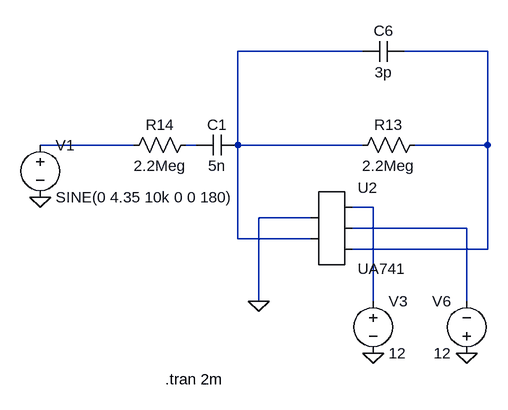
[diagram p0: schematic Filter.asc]
Filter.asc, the LTspice schematic file:
Version 4
SHEET 1 1892 832
WIRE 480 -128 288 -128
WIRE 672 -128 544 -128
WIRE 128 16 -16 16
WIRE 224 16 208 16
WIRE 288 16 288 -128
WIRE 480 16 288 16
WIRE 672 16 672 -128
WIRE 672 16 560 16
WIRE 496 112 464 112
WIRE 400 128 320 128
WIRE 640 144 464 144
WIRE 288 160 288 16
WIRE 400 160 288 160
WIRE 672 176 672 16
WIRE 672 176 464 176
WIRE 320 256 320 128
WIRE 496 256 496 112
WIRE 640 256 640 144
FLAG 320 256 0
FLAG 496 336 0
FLAG 640 336 0
FLAG -16 96 0
SYMBOL cap 288 0 R90
WINDOW 0 0 32 VBottom 2
WINDOW 3 32 32 VTop 2
SYMATTR InstName C1
SYMATTR Value 5n
SYMBOL cap 544 -144 R90
WINDOW 0 0 32 VBottom 2
WINDOW 3 32 32 VTop 2
SYMATTR InstName C6
SYMATTR Value 3p
SYMBOL res 576 0 R90
WINDOW 0 0 56 VBottom 2
WINDOW 3 32 56 VTop 2
SYMATTR InstName R13
SYMATTR Value 2.2Meg
SYMBOL res 224 0 R90
WINDOW 0 0 56 VBottom 2
WINDOW 3 32 56 VTop 2
SYMATTR InstName R14
SYMATTR Value 2.2Meg
SYMBOL AutoGenerated\\UA741 432 144 R0
SYMATTR InstName U2
SYMBOL voltage 496 240 R0
WINDOW 123 0 0 Left 0
WINDOW 39 0 0 Left 0
SYMATTR InstName V3
SYMATTR Value 12
SYMBOL voltage 640 352 R180
WINDOW 0 24 96 Left 2
WINDOW 3 24 16 Left 2
WINDOW 123 0 0 Left 0
WINDOW 39 0 0 Left 0
SYMATTR InstName V6
SYMATTR Value 12
SYMBOL voltage -16 0 R0
WINDOW 123 0 0 Left 0
WINDOW 39 0 0 Left 0
SYMATTR InstName V1
SYMATTR Value SINE(0 4.35 10k 0 0 180)
TEXT 176 376 Left 2 !.tran 2m

The netlist it stands for:
* Filter.asc
C1 N001 N004 5n
C6 N002 N001 3p
R13 N002 N001 2.2Meg
R14 N004 N003 2.2Meg
* U2: UA741 (symbol AutoGenerated\UA741 not available, pins judged from their places): pin1=0 pin2=N001 pin3=N005 pin4=N006 pin5=N002
V3 N005 0 12
V6 0 N006 12
V1 N003 0 SINE(0 4.35 10k 0 0 180)
.tran 2m
.backanno
.end